# EAGLE schematic PACT3DSchematic v1 (EAGLE 9.7.0)
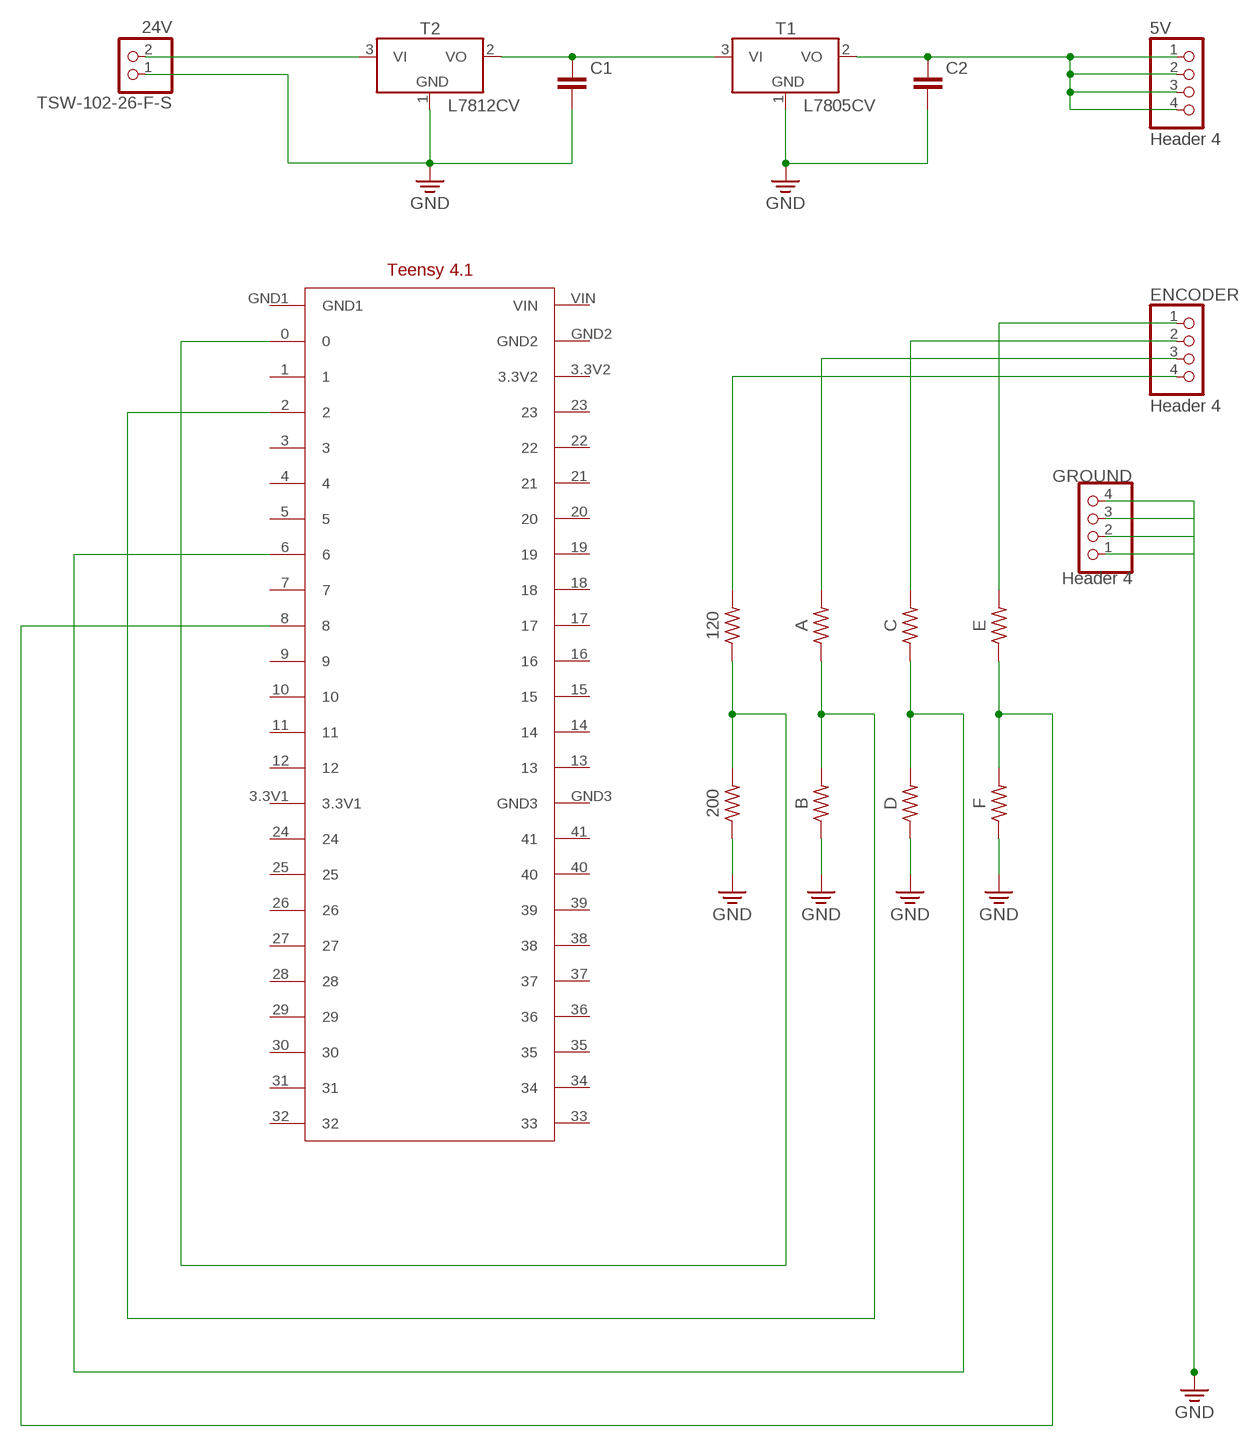
[diagram p0: schematic, sheet 1]

## Parts
5V  Header 4  PINHD-1X4/90  [1X04/90]
120  120  R-US_AXIAL-7.2MM-PITCH  [RESAD724W46L381D178B]
200  R-US_AXIAL-7.2MM-PITCH  [RESAD724W46L381D178B]
A  R-US_AXIAL-7.2MM-PITCH  [RESAD724W46L381D178B]
B  R-US_AXIAL-7.2MM-PITCH  [RESAD724W46L381D178B]
C  R-US_AXIAL-7.2MM-PITCH  [RESAD724W46L381D178B]
C1  C_RADIAL-55.5MM-DIA  [CAPRD2261W240D5080H5555B]
C2  C_RADIAL-55.5MM-DIA  [CAPRD2261W240D5080H5555B]
D  R-US_AXIAL-7.2MM-PITCH  [RESAD724W46L381D178B]
E  R-US_AXIAL-7.2MM-PITCH  [RESAD724W46L381D178B]
ENCODER  Header 4  PINHD-1X4/90  [1X04/90]
F  R-US_AXIAL-7.2MM-PITCH  [RESAD724W46L381D178B]
GROUND  Header 4  PINHD-1X4/90  [1X04/90]
T1  L7805CV  LD1117_TO220  [TO220V]
T2  L7812CV  LD1117_TO220  [TO220V]
TSW-102-26-F-S  24V  PINHD-1X2/90  [1X02/90]
U$1  TEENSY4.1  [TEENSY4.1FOOTPRINT]

## Nets
GND: 200.1 B.1 C1.2 C2.2 D.1 F.1 GROUND.1 GROUND.2 GROUND.3 GROUND.4 T1.1(GND) T2.1(GND) TSW-102-26-F-S.1
N$1: T2.3(VI) TSW-102-26-F-S.2
N$2: C1.1 T1.3(VI) T2.2(VO)
N$3: 5V.1 5V.2 5V.3 5V.4 C2.1 T1.2(VO)
N$4: E.2 ENCODER.1
N$5: E.1 F.2 U$1.8
N$6: C.2 ENCODER.2
N$7: C.1 D.2 U$1.6
N$8: A.2 ENCODER.3
N$9: A.1 B.2 U$1.2
N$10: 120.2 ENCODER.4
N$11: 120.1 200.2 U$1.0
Unconnected: U$1.1 U$1.3 U$1.3.3V1 U$1.3.3V2 U$1.4 U$1.5 U$1.7 U$1.9 U$1.10 U$1.11 U$1.12 U$1.13 U$1.14 U$1.15 U$1.16 U$1.17 U$1.18 U$1.19 U$1.20 U$1.21 U$1.22 U$1.23 U$1.24 U$1.25 U$1.26 U$1.27 U$1.28 U$1.29 U$1.30 U$1.31 U$1.32 U$1.33 U$1.34 U$1.35 U$1.36 U$1.37 U$1.38 U$1.39 U$1.40 U$1.41 U$1.GND1 U$1.GND2 U$1.GND3 U$1.VIN

## Library data of the parts
5V ENCODER GROUND = Connector:PINHD-1X4: PIN HEADER; CATEGORY: Headers; DESCRIPTION: Header, Right Angle, 4 Position; MANUFACTURER: Generic; MPN: Generic; OPERATING_TEMPERATURE: Generic; PART_STATUS: Active; PITCH: 0.100" (2.54mm); ROHS_COMPLIANCE: Generic; SERIES: Generic; SUB-CATEGORY: Headers, Male Pins; TYPE: Board to Board or Cable, Unshrouded, Through Hole, Right Angle
120 200 A B C D E F = Resistor:R-US: Resistor Fixed - ANSI; CATEGORY: Resistor; SUB-CATEGORY: Fixed
C1 C2 = Capacitor:C: Capacitor - Generic; CATEGORY: Capacitor
T1 T2 = IC_Power-Management:LD1117: Adjustable and fixed positive voltage regulator Reference Datasheet <https://www.st.com/content/ccc/resource/technical/document/datasheet/99/3b/7d/91/91/51/4b/be/CD00000544.pdf/files/CD00000544.pdf/jcr:content/translations/en.CD00000544.pdf>; CATEGORY: IC_Linear; DESCRIPTION: Adjustable voltage regulator; MANUFACTURER: STMicroelectronics; MPN: Generic; SERIES: LM1117; SUB-CATEGORY: Voltage Regulator; TYPE: Linear
TSW-102-26-F-S = Connector:PINHD-1X2: PIN HEADER; CATEGORY: Headers; DESCRIPTION: Header, Right Angle, 2 Position; MANUFACTURER: Generic; MPN: Generic; OPERATING_TEMPERATURE: Generic; PART_STATUS: Active; PITCH: 0.100" (2.54mm); ROHS_COMPLIANCE: Generic; SERIES: Generic; SUB-CATEGORY: Headers, Male Pins; TYPE: Board to Board or Cable, Unshrouded, Through Hole, Right Angle
U$1 = Teensy 4.1 Board Design:TEENSY4.1